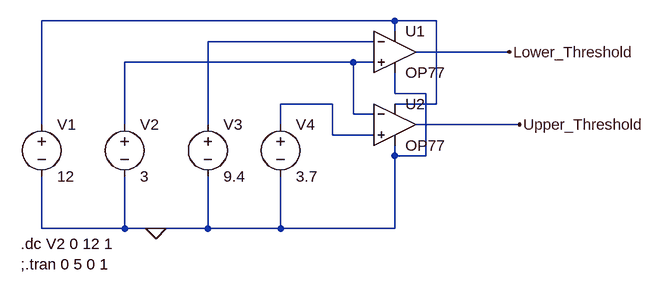
[diagram p0: schematic ComparatorDesign1.asc]
ComparatorDesign1.asc, the LTspice schematic file:
Version 4
SHEET 1 984 680
WIRE 576 -48 32 -48
WIRE 640 -48 576 -48
WIRE 576 -32 576 -48
WIRE 544 -16 288 -16
WIRE 752 0 608 0
WIRE 512 16 160 16
WIRE 544 16 512 16
WIRE 576 64 576 32
WIRE 624 64 576 64
WIRE 480 80 400 80
WIRE 640 80 640 -48
WIRE 640 80 576 80
WIRE 512 96 512 16
WIRE 544 96 512 96
WIRE 32 112 32 -48
WIRE 160 112 160 16
WIRE 288 112 288 -16
WIRE 400 112 400 80
WIRE 768 112 608 112
WIRE 480 128 480 80
WIRE 544 128 480 128
WIRE 576 160 576 144
WIRE 624 160 624 64
WIRE 624 160 576 160
WIRE 32 272 32 192
WIRE 160 272 160 192
WIRE 160 272 32 272
WIRE 208 272 160 272
WIRE 288 272 288 192
WIRE 288 272 208 272
WIRE 400 272 400 192
WIRE 400 272 288 272
WIRE 576 272 576 160
WIRE 576 272 400 272
FLAG 208 272 0
FLAG 768 112 Upper_Threshold
FLAG 752 0 Lower_Threshold
SYMBOL voltage 32 96 R0
SYMATTR InstName V1
SYMATTR Value 12
SYMBOL voltage 160 96 R0
SYMATTR InstName V2
SYMATTR Value 3
SYMBOL voltage 288 96 R0
SYMATTR InstName V3
SYMATTR Value 9.4
SYMBOL voltage 400 96 R0
SYMATTR InstName V4
SYMATTR Value 3.7
SYMBOL OpAmps\\OP77 576 -64 R0
SYMATTR InstName U1
SYMBOL OpAmps\\OP77 576 48 R0
SYMATTR InstName U2
TEXT 0 296 Left 2 !.dc V2 0 12 1\n;.tran 0 5 0 1

The netlist it stands for:
* ComparatorDesign1.asc
V1 N001 0 12
V2 N003 0 3
V3 N002 0 9.4
V4 N004 0 3.7
XU1 N003 N002 N001 0 Lower_Threshold OP77  ; pins In+ In- V+ V- OUT
XU2 N004 N003 N001 0 Upper_Threshold OP77  ; pins In+ In- V+ V- OUT
.dc V2 0 12 1
;.tran 0 5 0 1
.lib ADI.lib
.backanno
.end